# Altium schematic sheet VCA821_PGA.SchDoc
size A4
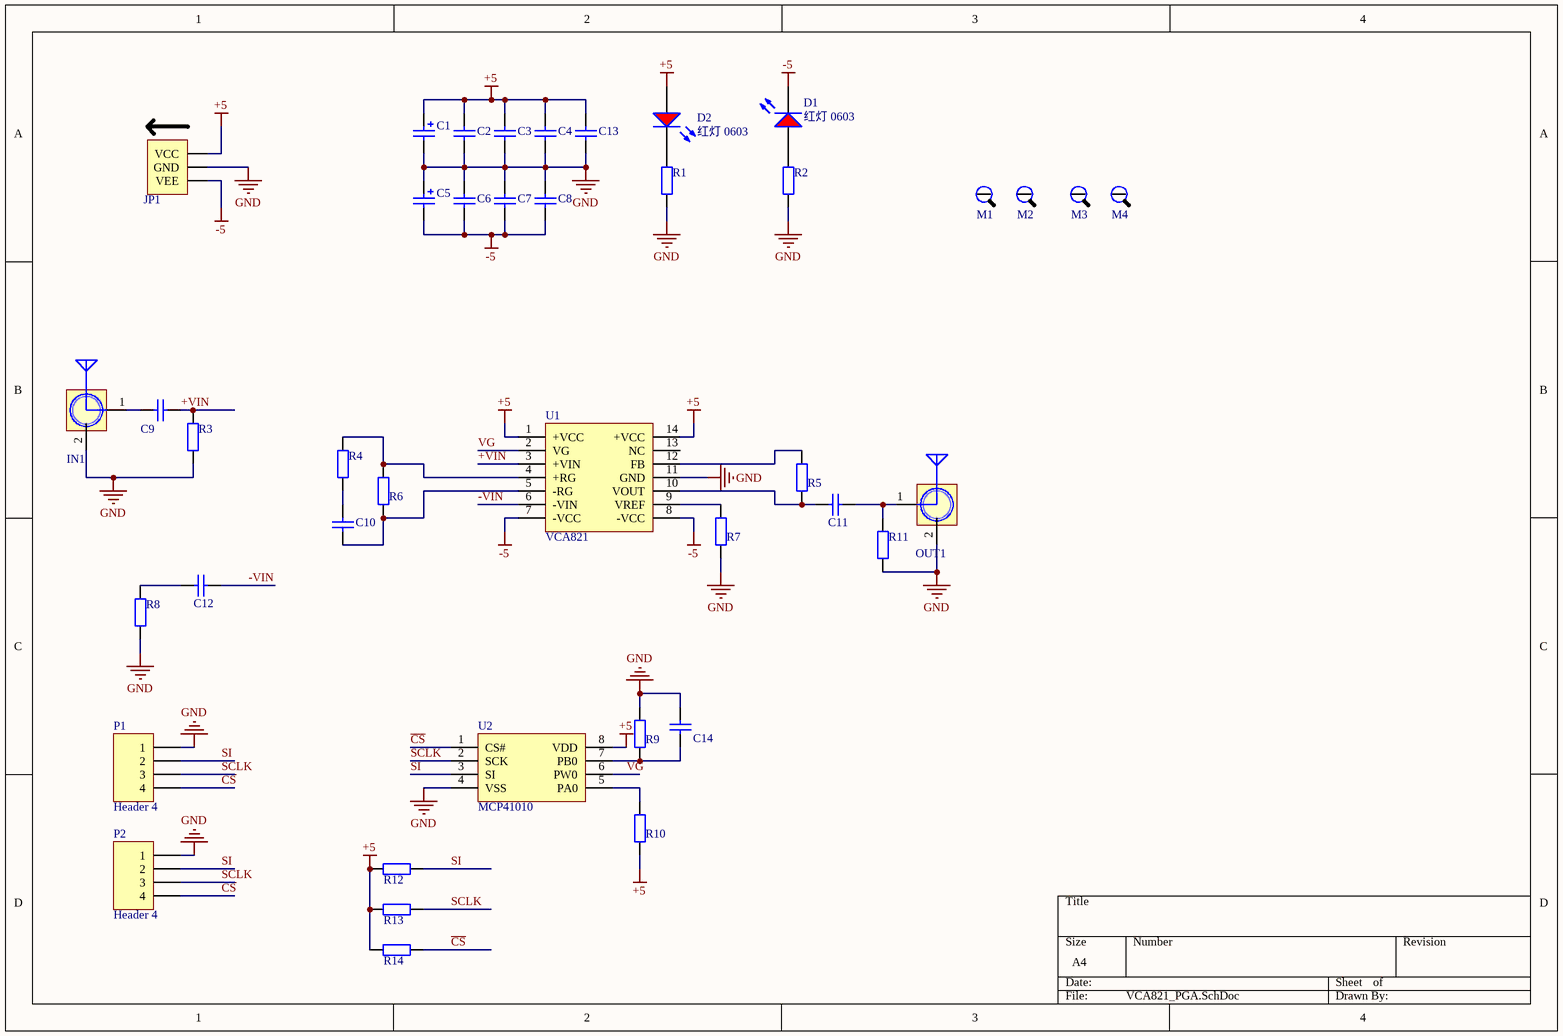
[diagram p0: VCA821_PGA.SchDoc]

## Parts
C1  10uF (106) ±10% 16V  [CASE-A_3216]  (value not drawn)
C2  100nF (104) 10% 50V  [0603_C]  (value not drawn)
C3  100nF (104) 10% 50V  [0603_C]  (value not drawn)
C4  100nF (104) 10% 50V  [0603_C]  (value not drawn)
C5  10uF (106) ±10% 16V  [CASE-A_3216]  (value not drawn)
C6  100nF (104) 10% 50V  [0603_C]  (value not drawn)
C7  100nF (104) 10% 50V  [0603_C]  (value not drawn)
C8  100nF (104) 10% 50V  [0603_C]  (value not drawn)
C9  100nF (104) 10% 50V  [0603_C]  (value not drawn)
C10  100nF (104) 10% 50V  [0603_C]  (value not drawn)
C11  100nF (104) 10% 50V  [0603_C]  (value not drawn)
C12  100nF (104) 10% 50V  [0603_C]  (value not drawn)
C13  100nF (104) 10% 50V  [0603_C]  (value not drawn)
C14  100nF (104) 10% 50V  [0603_C]  (value not drawn)
D1  红灯 0603  [0603_LED_S1]
D2  红灯 0603  [0603_LED_S1]
IN1  SMA WIFI 天线接口  [SMA]  (value not drawn)
JP1  HDR-1X3  [Power_IN_3.81-3P]  (value not drawn)
M1  M3  [M3x10_L]  (value not drawn)
M2  M3  [M3x10_L]  (value not drawn)
M3  M3  [M3x10_L]  (value not drawn)
M4  M3  [M3x10_L]  (value not drawn)
OUT1  SMA WIFI 天线接口  [SMA]  (value not drawn)
P1  Header 4  [MX 1.25-WS-4P]
P2  Header 4  [HDR1X4]
R1  10KΩ (1002) ±1%  [0603_R]  (value not drawn)
R2  10KΩ (1002) ±1%  [0603_R]  (value not drawn)
R3  10KΩ (1002) ±1%  [0603_R]  (value not drawn)
R4  10KΩ (1002) ±1%  [0603_R]  (value not drawn)
R5  10KΩ (1002) ±1%  [0603_R]  (value not drawn)
R6  10KΩ (1002) ±1%  [0603_R]  (value not drawn)
R7  10KΩ (1002) ±1%  [0603_R]  (value not drawn)
R8  10KΩ (1002) ±1%  [0603_R]  (value not drawn)
R9  10KΩ (1002) ±1%  [0603_R]  (value not drawn)
R10  10KΩ (1002) ±1%  [0603_R]  (value not drawn)
R11  10KΩ (1002) ±1%  [0603_R]  (value not drawn)
R12  10KΩ (1002) ±1%  [0603_R]  (value not drawn)
R13  10KΩ (1002) ±1%  [0603_R]  (value not drawn)
R14  10KΩ (1002) ±1%  [0603_R]  (value not drawn)
U1  VCA821  [SO-14N]
U2  MCP41010  [SOIC-8]

## Nets
+5: C1.1 C2.2 C3.2 C4.2 C13.2 D2.A JP1.1(VCC) R10.2 R12.1 R13.1 R14.1 U1.1(+VCC) U1.14(+VCC) U2.8(VDD)
-5: C5.2 C6.1 C7.1 C8.1 D1.K JP1.3(VEE) U1.7(-VCC) U1.8(-VCC)
GND: C1.2 C2.1 C3.1 C4.1 C5.1 C6.2 C7.2 C8.2 C13.1 C14.1 IN1.2 JP1.2(GND) OUT1.2 P1.1 P2.1 R1.1 R2.1 R3.1 R7.2 R8.1 R9.1 R11.1 U1.11(GND) U2.4(VSS)
+VIN: C9.1 R3.2 U1.3(+VIN)
-VIN: C12.1 U1.6(-VIN)
~{CS}: P1.4 P2.4 R14.2 U2.1(CS#)
SCLK: P1.3 P2.3 R13.2 U2.2(SCK)
SI: P1.2 P2.2 R12.2 U2.3(SI)
VG: U1.2(VG) U2.6(PW0)
NetC9_2: C9.2 IN1.1(SINGLE)
NetC10_1: C10.1 R6.2 U1.5(-RG)
NetC10_2: C10.2 R4.1
NetC11_1: C11.1 OUT1.1(SINGLE) R11.2
NetC11_2: C11.2 R5.2 U1.10(VOUT)
NetC12_2: C12.2 R8.2
NetC14_2: C14.2 R9.2 U2.7(PB0)
NetD1_A: D1.A R2.2
NetD2_K: D2.K R1.2
NetR4_2: R4.2 R6.1 U1.4(+RG)
NetR5_1: R5.1 U1.12(FB)
NetR7_1: R7.1 U1.9(VREF)
NetR10_1: R10.1 U2.5(PA0)

Not connected (* = marked no-connect by the designer): M1 1; M2 1; M3 1; M4 1; U1 13(NC)

## Library data of the parts
C1 C5 = 3216 10uF (106) 10% 16V: 钽电容; ComponentLink1Description: 供应商链接; ComponentLink1URL: http://www.szlcsc.com/product/details_7643.html; Package: 3216; Supplier: LC; SuppliersPartNumber: C7171
C2-C4 C6-C14 = 0603 100nF (104) 10% 50V: 贴片电容; ComponentLink1Description: 供应商链接; ComponentLink1URL: http://www.szlcsc.com/product/details_15331.html; Package: 0603; Supplier: LC; SuppliersPartNumber: C14663
D1 D2 = 0603 红灯: 发光二极管; ComponentLink1Description: 供应商链接; ComponentLink1URL: http://www.szlcsc.com/product/details_2659.html; Package: 0603; Supplier: LC; SuppliersPartNumber: C2286
IN1 OUT1 = PORT_SMA: SMA-2.4G射频天线接口; 版权归属: 源创客; BOM名称: SMA-2.4G射频天线接口; 学习资源: www.ooocke.com
JP1 = PORT_Power_IN3: 3P接插件,模块双电源供电口; 版权归属: 源创客; BOM名称: 3P接插件; 学习资源: www.ooocke.com
M1-M4 = ELSE_M3_screw: 螺丝
P1 P2 = Header 4: Header, 4-Pin; LatestRevisionDate: 17-Jul-2002; LatestRevisionNote: Re-released for DXP Platform.; Publisher: Altium Limited
R1-R14 = 0603 10KΩ (1002) 1%: 贴片电阻; ComponentLink1Description: 供应商链接; ComponentLink1URL: http://www.szlcsc.com/product/details_26547.html; Package: 0603; Supplier: LC; SuppliersPartNumber: C25804
U2 = IC_MCP41010T